# Altium project P003_LED_Strip.PrjPcb
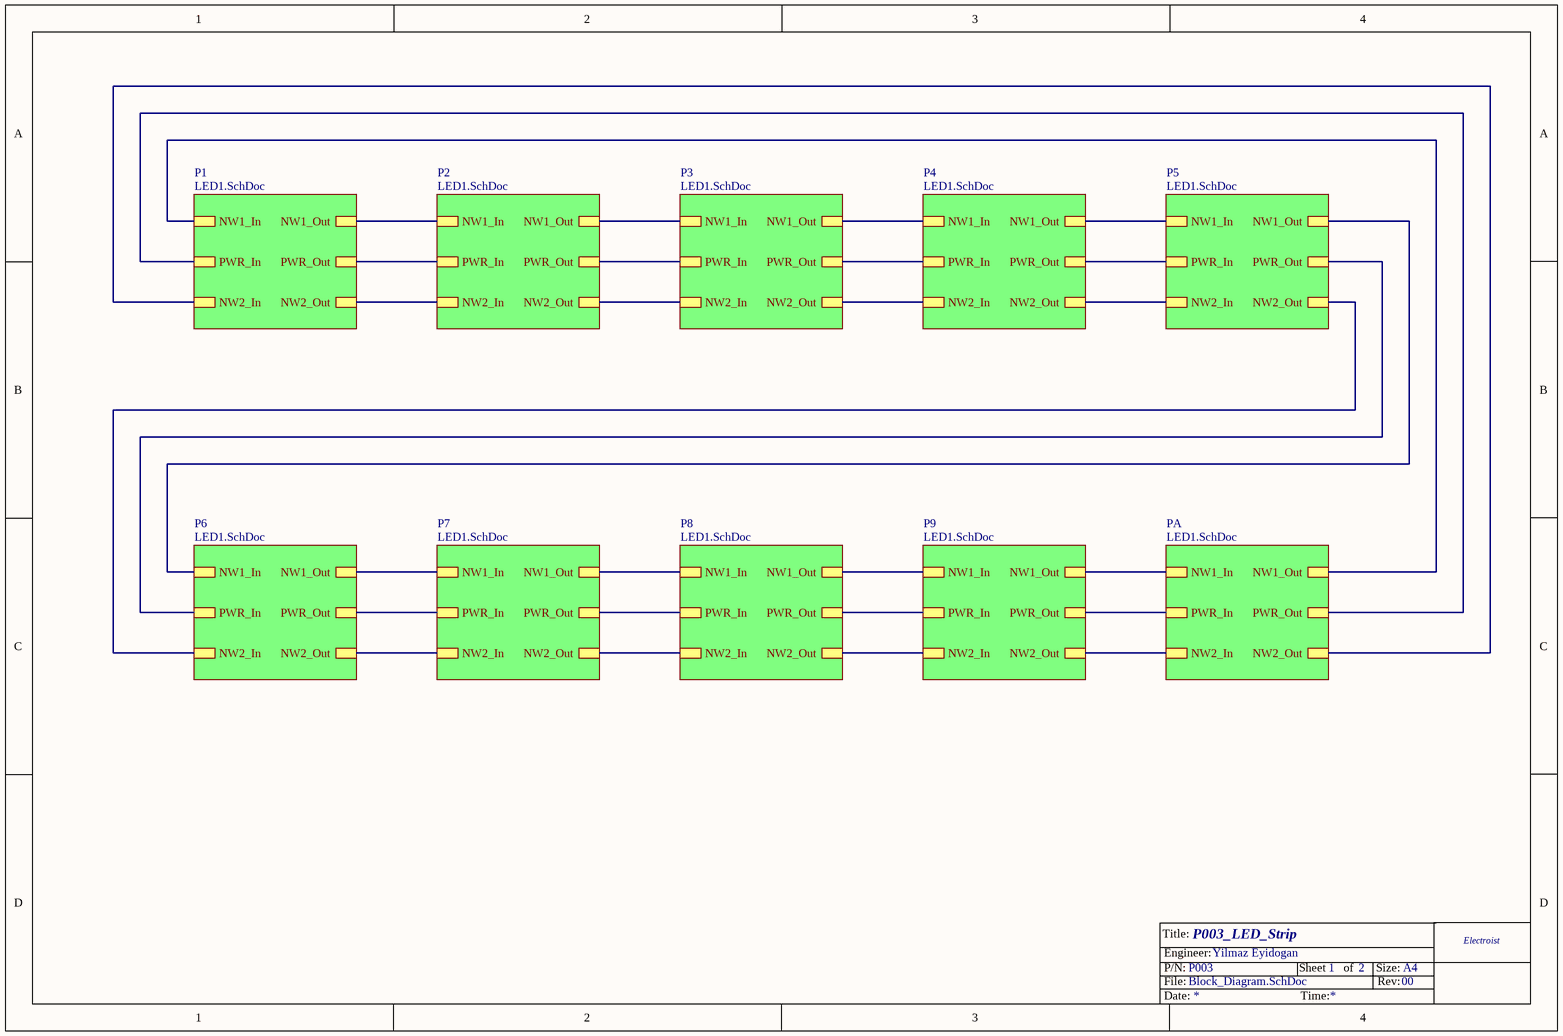
[diagram p0: Block_Diagram.SchDoc]
Engineer_Prj: Yilmaz Eyidogan; PN_Prj: P003; Rev_Prj: 00; Title_Prj: P003_LED_Strip
2 sheets, 160 parts. Net scope: hierarchical (ports join the sheet entries above them; power ports are global).
Board file: P003_LED_Strip.PcbDoc
Sheets:
  Block_Diagram.SchDoc
    P1 = LED1.SchDoc
    P2 = LED1.SchDoc
    P3 = LED1.SchDoc
    P4 = LED1.SchDoc
    P5 = LED1.SchDoc
    P6 = LED1.SchDoc
    P7 = LED1.SchDoc
    P8 = LED1.SchDoc
    P9 = LED1.SchDoc
    PA = LED1.SchDoc

## Sheet Block_Diagram.SchDoc
size A4; Organization: Altium Limited; Address1: L3, 12a Rodborough Rd; Address2: Frenchs Forest; Address3: NSW; Address4: Australia 2086; SheetNumber: 1; SheetTotal: 2

### Sub-sheets
P1 = LED1.SchDoc: NW1_In, NW1_Out, NW2_In, NW2_Out, PWR_In, PWR_Out
P2 = LED1.SchDoc: NW1_In, NW1_Out, NW2_In, NW2_Out, PWR_In, PWR_Out
P3 = LED1.SchDoc: NW1_In, NW1_Out, NW2_In, NW2_Out, PWR_In, PWR_Out
P4 = LED1.SchDoc: NW1_In, NW1_Out, NW2_In, NW2_Out, PWR_In, PWR_Out
P5 = LED1.SchDoc: NW1_In, NW1_Out, NW2_In, NW2_Out, PWR_In, PWR_Out
P6 = LED1.SchDoc: NW1_In, NW1_Out, NW2_In, NW2_Out, PWR_In, PWR_Out
P7 = LED1.SchDoc: NW1_In, NW1_Out, NW2_In, NW2_Out, PWR_In, PWR_Out
P8 = LED1.SchDoc: NW1_In, NW1_Out, NW2_In, NW2_Out, PWR_In, PWR_Out
P9 = LED1.SchDoc: NW1_In, NW1_Out, NW2_In, NW2_Out, PWR_In, PWR_Out
PA = LED1.SchDoc: NW1_In, NW1_Out, NW2_In, NW2_Out, PWR_In, PWR_Out

### Nets
NW1_In: sheet P1/NW1_In, sheet P1/NW1_Out, sheet P2/NW1_In, sheet P2/NW1_Out, sheet P3/NW1_In, sheet P3/NW1_Out, sheet P4/NW1_In, sheet P4/NW1_Out, sheet P5/NW1_In, sheet P5/NW1_Out, sheet P6/NW1_In, sheet P6/NW1_Out, sheet P7/NW1_In, sheet P7/NW1_Out, sheet P8/NW1_In, sheet P8/NW1_Out, sheet P9/NW1_In, sheet P9/NW1_Out, sheet PA/NW1_In, sheet PA/NW1_Out
NW2_In: sheet P1/NW2_In, sheet P1/NW2_Out, sheet P2/NW2_In, sheet P2/NW2_Out, sheet P3/NW2_In, sheet P3/NW2_Out, sheet P4/NW2_In, sheet P4/NW2_Out, sheet P5/NW2_In, sheet P5/NW2_Out, sheet P6/NW2_In, sheet P6/NW2_Out, sheet P7/NW2_In, sheet P7/NW2_Out, sheet P8/NW2_In, sheet P8/NW2_Out, sheet P9/NW2_In, sheet P9/NW2_Out, sheet PA/NW2_In, sheet PA/NW2_Out
PWR_In: sheet P1/PWR_In, sheet P1/PWR_Out, sheet P2/PWR_In, sheet P2/PWR_Out, sheet P3/PWR_In, sheet P3/PWR_Out, sheet P4/PWR_In, sheet P4/PWR_Out, sheet P5/PWR_In, sheet P5/PWR_Out, sheet P6/PWR_In, sheet P6/PWR_Out, sheet P7/PWR_In, sheet P7/PWR_Out, sheet P8/PWR_In, sheet P8/PWR_Out, sheet P9/PWR_In, sheet P9/PWR_Out, sheet PA/PWR_In, sheet PA/PWR_Out

### Notes on the sheet
- Title:
- File:
- P/N:
- Engineer:
- Sheet
- of
- Size:
- Rev:
- A4
- Electroist
- Date:
- Time:

## Sheet LED1.SchDoc
size A4; Organization: Altium Limited; Address1: L3, 12a Rodborough Rd; Address2: Frenchs Forest; Address3: NSW; Address4: Australia 2086; SheetNumber: 2; SheetTotal: 2
Used 10 times, as channels P1, P2, P3, P4, P5, P6, P7, P8, P9, PA. Parts and nets are listed once, with the designators drawn on the sheet.
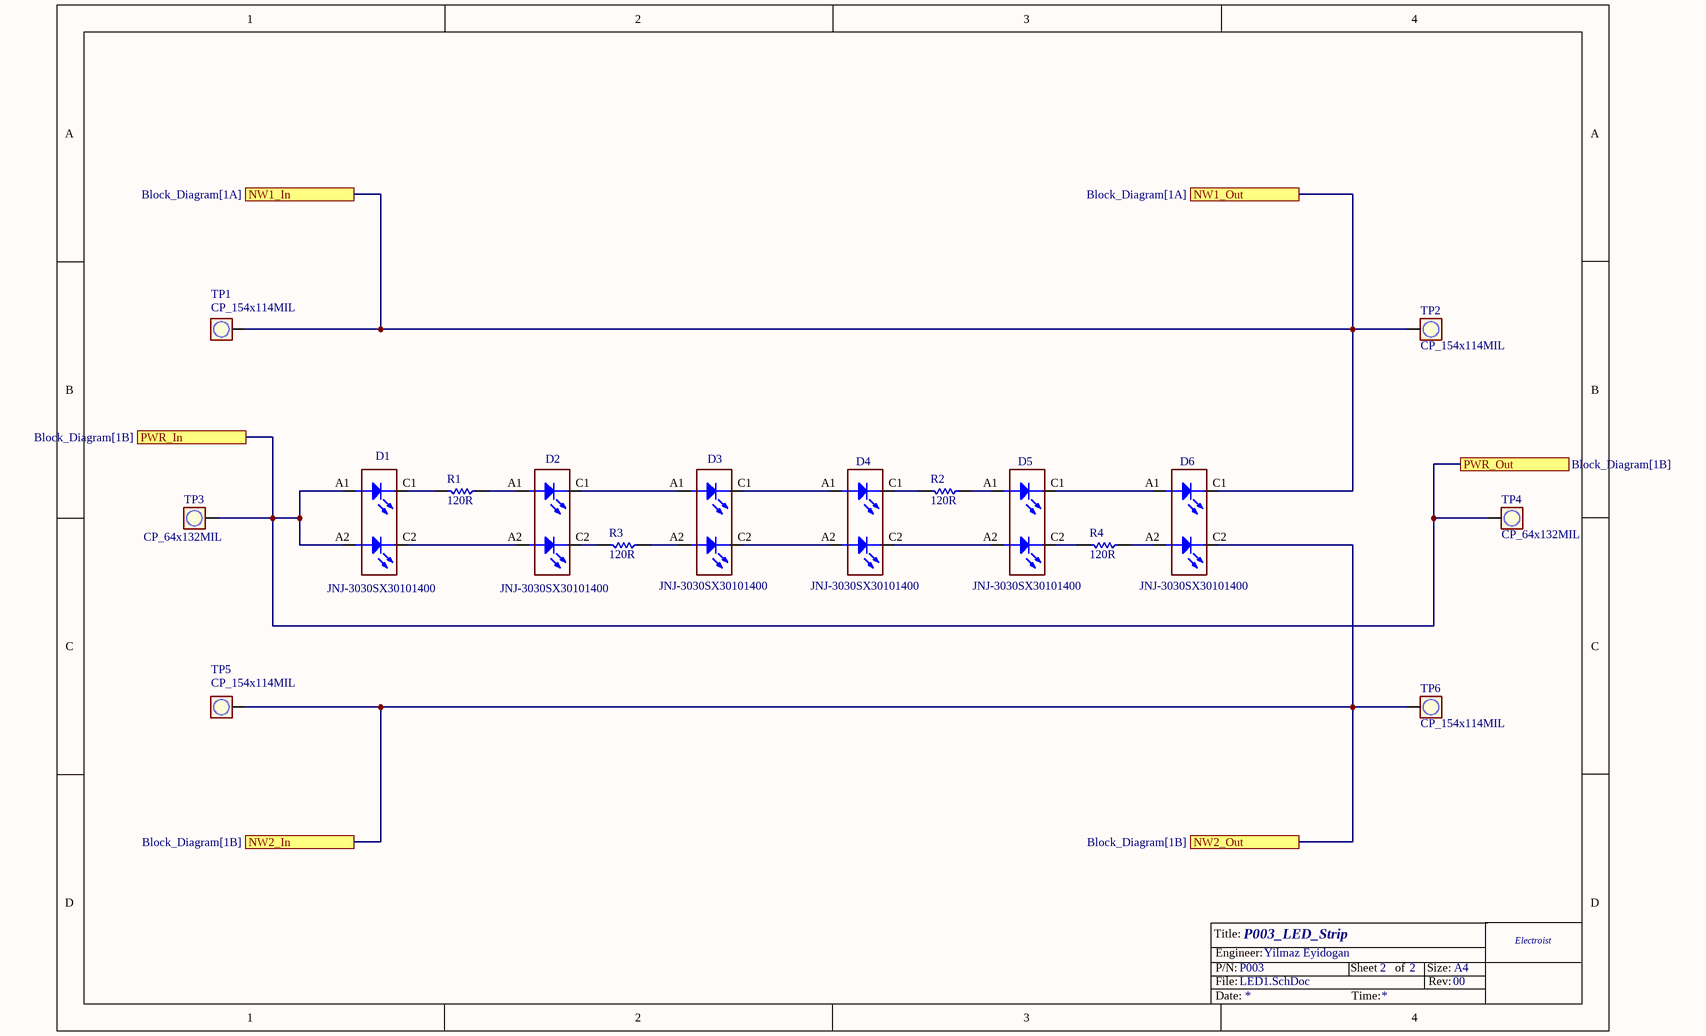
[diagram p1: LED1.SchDoc]

### Parts
D1  JNJ-3030SX30101400  [LED_3030_4P_1]
D2  JNJ-3030SX30101400  [LED_3030_4P_1]
D3  JNJ-3030SX30101400  [LED_3030_4P_1]
D4  JNJ-3030SX30101400  [LED_3030_4P_1]
D5  JNJ-3030SX30101400  [LED_3030_4P_1]
D6  JNJ-3030SX30101400  [LED_3030_4P_1]
R1  120R  [RES_CHIP_3216[1206]_N]
R2  120R  [RES_CHIP_3216[1206]_N]
R3  120R  [RES_CHIP_3216[1206]_N]
R4  120R  [RES_CHIP_3216[1206]_N]
TP1  CP_154x114MIL  [TST_CP_154x114MIL]
TP2  CP_154x114MIL  [TST_CP_154x114MIL]
TP3  CP_64x132MIL  [TST_CP_64x132MIL_1]
TP4  CP_64x132MIL  [TST_CP_64x132MIL_1]
TP5  CP_154x114MIL  [TST_CP_154x114MIL]
TP6  CP_154x114MIL  [TST_CP_154x114MIL]

### Ports
NW1_In (see Block_Diagram[1A]), NW1_Out (see Block_Diagram[1A]), NW2_In (see Block_Diagram[1B]), NW2_Out (see Block_Diagram[1B]), PWR_In (see Block_Diagram[1B]), PWR_Out (see Block_Diagram[1B])

### Nets
NW1_In: D6.C1 TP1.1 TP2.1 ; port NW1_In, port NW1_Out
NW2_In: D6.C2 TP5.1 TP6.1 ; port NW2_In, port NW2_Out
PWR_In: D1.A1 D1.A2 TP3.1 TP4.1 ; port PWR_In, port PWR_Out
NetD1_C1: D1.C1 R1.2
NetD1_C2: D1.C2 D2.A2
NetD2_A1: D2.A1 R1.1
NetD2_C1: D2.C1 D3.A1
NetD2_C2: D2.C2 R3.2
NetD3_A2: D3.A2 R3.1
NetD3_C1: D3.C1 D4.A1
NetD3_C2: D3.C2 D4.A2
NetD4_C1: D4.C1 R2.2
NetD4_C2: D4.C2 D5.A2
NetD5_A1: D5.A1 R2.1
NetD5_C1: D5.C1 D6.A1
NetD5_C2: D5.C2 R4.2
NetD6_A2: D6.A2 R4.1

### Channels
P1: designators end in _P1; ports NW1_In=NW1_In NW1_Out=NW1_In NW2_In=NW2_In NW2_Out=NW2_In PWR_In=PWR_In PWR_Out=PWR_In
P2: designators end in _P2; ports NW1_In=NW1_In NW1_Out=NW1_In NW2_In=NW2_In NW2_Out=NW2_In PWR_In=PWR_In PWR_Out=PWR_In
P3: designators end in _P3; ports NW1_In=NW1_In NW1_Out=NW1_In NW2_In=NW2_In NW2_Out=NW2_In PWR_In=PWR_In PWR_Out=PWR_In
P4: designators end in _P4; ports NW1_In=NW1_In NW1_Out=NW1_In NW2_In=NW2_In NW2_Out=NW2_In PWR_In=PWR_In PWR_Out=PWR_In
P5: designators end in _P5; ports NW1_In=NW1_In NW1_Out=NW1_In NW2_In=NW2_In NW2_Out=NW2_In PWR_In=PWR_In PWR_Out=PWR_In
P6: designators end in _P6; ports NW1_In=NW1_In NW1_Out=NW1_In NW2_In=NW2_In NW2_Out=NW2_In PWR_In=PWR_In PWR_Out=PWR_In
P7: designators end in _P7; ports NW1_In=NW1_In NW1_Out=NW1_In NW2_In=NW2_In NW2_Out=NW2_In PWR_In=PWR_In PWR_Out=PWR_In
P8: designators end in _P8; ports NW1_In=NW1_In NW1_Out=NW1_In NW2_In=NW2_In NW2_Out=NW2_In PWR_In=PWR_In PWR_Out=PWR_In
P9: designators end in _P9; ports NW1_In=NW1_In NW1_Out=NW1_In NW2_In=NW2_In NW2_Out=NW2_In PWR_In=PWR_In PWR_Out=PWR_In
PA: designators end in _PA; ports NW1_In=NW1_In NW1_Out=NW1_In NW2_In=NW2_In NW2_Out=NW2_In PWR_In=PWR_In PWR_Out=PWR_In

### Notes on the sheet
- Title:
- File:
- P/N:
- Engineer:
- Sheet
- of
- Size:
- Rev:
- A4
- Electroist
- Date:
- Time:

### Library data of the parts
D1-D6 = 15: Dual LED, 3030 4 pin package; Manufacturer: JNJ Optoelectronics; ID: 15; Voltage: 3.1V; Current: 150mA; SMD/THD: SMD; Alternates: Guangzhou Mingyi Optoelectronics: 854-1; Part Number: JNJ-3030SX30101400; Pin Count: 4; Value: JNJ-3030SX30101400; ComponentLink1Description: Component web page; ComponentLink1URL: https://www.lcsc.com/product-detail/C19185854.html?s_z=s_C19185854; Manufacturer P/N: JNJ-3030SX30101400; Published Date: 2025-08-29; Publisher: YE
R1-R4 = 43: 120 ohm, 1206, 250 mW, 200 V, %10; Part Number: 120R_1206; ID: 43; Voltage: 200V; Power: 250mW; Tolerance(%): 10; Type 1: Film; SMD/THD: SMD; Pin Count: 2; Value: 120R; Package Reference: 1206; Published Date: 19.03.2021; Publisher: YE
TP1 TP2 TP5 TP6 = 4: no via; ID: 4; SMD/THD: Manual; Part Number: CP_154x114MIL; Pin Count: 1; Value: CP_154x114MIL; Published Date: 2025-08-29; Publisher: YE
TP3 TP4 = 5: includes 3 vias; ID: 5; SMD/THD: Manual; Part Number: CP_64x132MIL; Pin Count: 1; Value: CP_64x132MIL; Published Date: 2025-08-29; Publisher: YE

## Nets that join several sheets
NW1_In: P1 (D6_P1.C1 TP1_P1.1 TP2_P1.1), P2 (D6_P2.C1 TP1_P2.1 TP2_P2.1), P3 (D6_P3.C1 TP1_P3.1 TP2_P3.1), P4 (D6_P4.C1 TP1_P4.1 TP2_P4.1), P5 (D6_P5.C1 TP1_P5.1 TP2_P5.1), P6 (D6_P6.C1 TP1_P6.1 TP2_P6.1), P7 (D6_P7.C1 TP1_P7.1 TP2_P7.1), P8 (D6_P8.C1 TP1_P8.1 TP2_P8.1), P9 (D6_P9.C1 TP1_P9.1 TP2_P9.1), PA (D6_PA.C1 TP1_PA.1 TP2_PA.1)
NW2_In: P1 (D6_P1.C2 TP5_P1.1 TP6_P1.1), P2 (D6_P2.C2 TP5_P2.1 TP6_P2.1), P3 (D6_P3.C2 TP5_P3.1 TP6_P3.1), P4 (D6_P4.C2 TP5_P4.1 TP6_P4.1), P5 (D6_P5.C2 TP5_P5.1 TP6_P5.1), P6 (D6_P6.C2 TP5_P6.1 TP6_P6.1), P7 (D6_P7.C2 TP5_P7.1 TP6_P7.1), P8 (D6_P8.C2 TP5_P8.1 TP6_P8.1), P9 (D6_P9.C2 TP5_P9.1 TP6_P9.1), PA (D6_PA.C2 TP5_PA.1 TP6_PA.1)
PWR_In: P1 (D1_P1.A1 D1_P1.A2 TP3_P1.1 TP4_P1.1), P2 (D1_P2.A1 D1_P2.A2 TP3_P2.1 TP4_P2.1), P3 (D1_P3.A1 D1_P3.A2 TP3_P3.1 TP4_P3.1), P4 (D1_P4.A1 D1_P4.A2 TP3_P4.1 TP4_P4.1), P5 (D1_P5.A1 D1_P5.A2 TP3_P5.1 TP4_P5.1), P6 (D1_P6.A1 D1_P6.A2 TP3_P6.1 TP4_P6.1), P7 (D1_P7.A1 D1_P7.A2 TP3_P7.1 TP4_P7.1), P8 (D1_P8.A1 D1_P8.A2 TP3_P8.1 TP4_P8.1), P9 (D1_P9.A1 D1_P9.A2 TP3_P9.1 TP4_P9.1), PA (D1_PA.A1 D1_PA.A2 TP3_PA.1 TP4_PA.1)

## Assembly variants
Std: not fitted TP1_P1 TP1_P2 TP1_P3 TP1_P4 TP1_P5 TP1_P6 TP1_P7 TP1_P8 TP1_P9 TP1_PA TP2_P1 TP2_P2 TP2_P3 TP2_P4 TP2_P5 TP2_P6 TP2_P7 TP2_P8 TP2_P9 TP2_PA TP3_P1 TP3_P2 TP3_P3 TP3_P4 TP3_P5 TP3_P6 TP3_P7 TP3_P8 TP3_P9 TP3_PA TP4_P1 TP4_P2 TP4_P3 TP4_P4 TP4_P5 TP4_P6 TP4_P7 TP4_P8 TP4_P9 TP4_PA TP5_P1 TP5_P2 TP5_P3 TP5_P4 TP5_P5 TP5_P6 TP5_P7 TP5_P8 TP5_P9 TP5_PA TP6_P1 TP6_P2 TP6_P3 TP6_P4 TP6_P5 TP6_P6 TP6_P7 TP6_P8 TP6_P9 TP6_PA